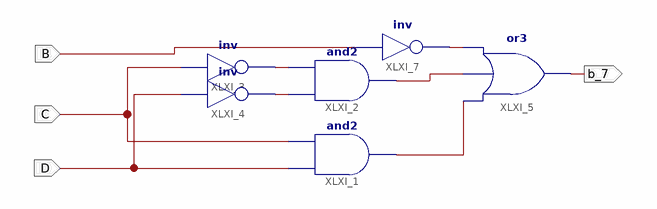
[diagram p0: schematic sheet 1]
// Xilinx ISE schematic b_7.sch (spartan6) as structural Verilog: 6 symbols, 4 ports
module b_7 (
  input  C,
  input  D,
  input  B,
  output b_7
);

  wire XLXN_8, XLXN_9, XLXN_12, XLXN_14, XLXN_15;

  and XLXI_1 (XLXN_14, D, C);
  and XLXI_2 (XLXN_12, XLXN_9, XLXN_8);
  not XLXI_3 (XLXN_8, C);
  not XLXI_4 (XLXN_9, D);
  or XLXI_5 (b_7, XLXN_14, XLXN_12, XLXN_15);
  not XLXI_7 (XLXN_15, B);
endmodule
